# EasyEDA schematic CLAMPER SCHEMATIC.json
TITLE: Sheet_1; REV: 1.0; Date: 2023-09-25; Sheet: 1/1; Drawn By: pv8821; Company: Your Company
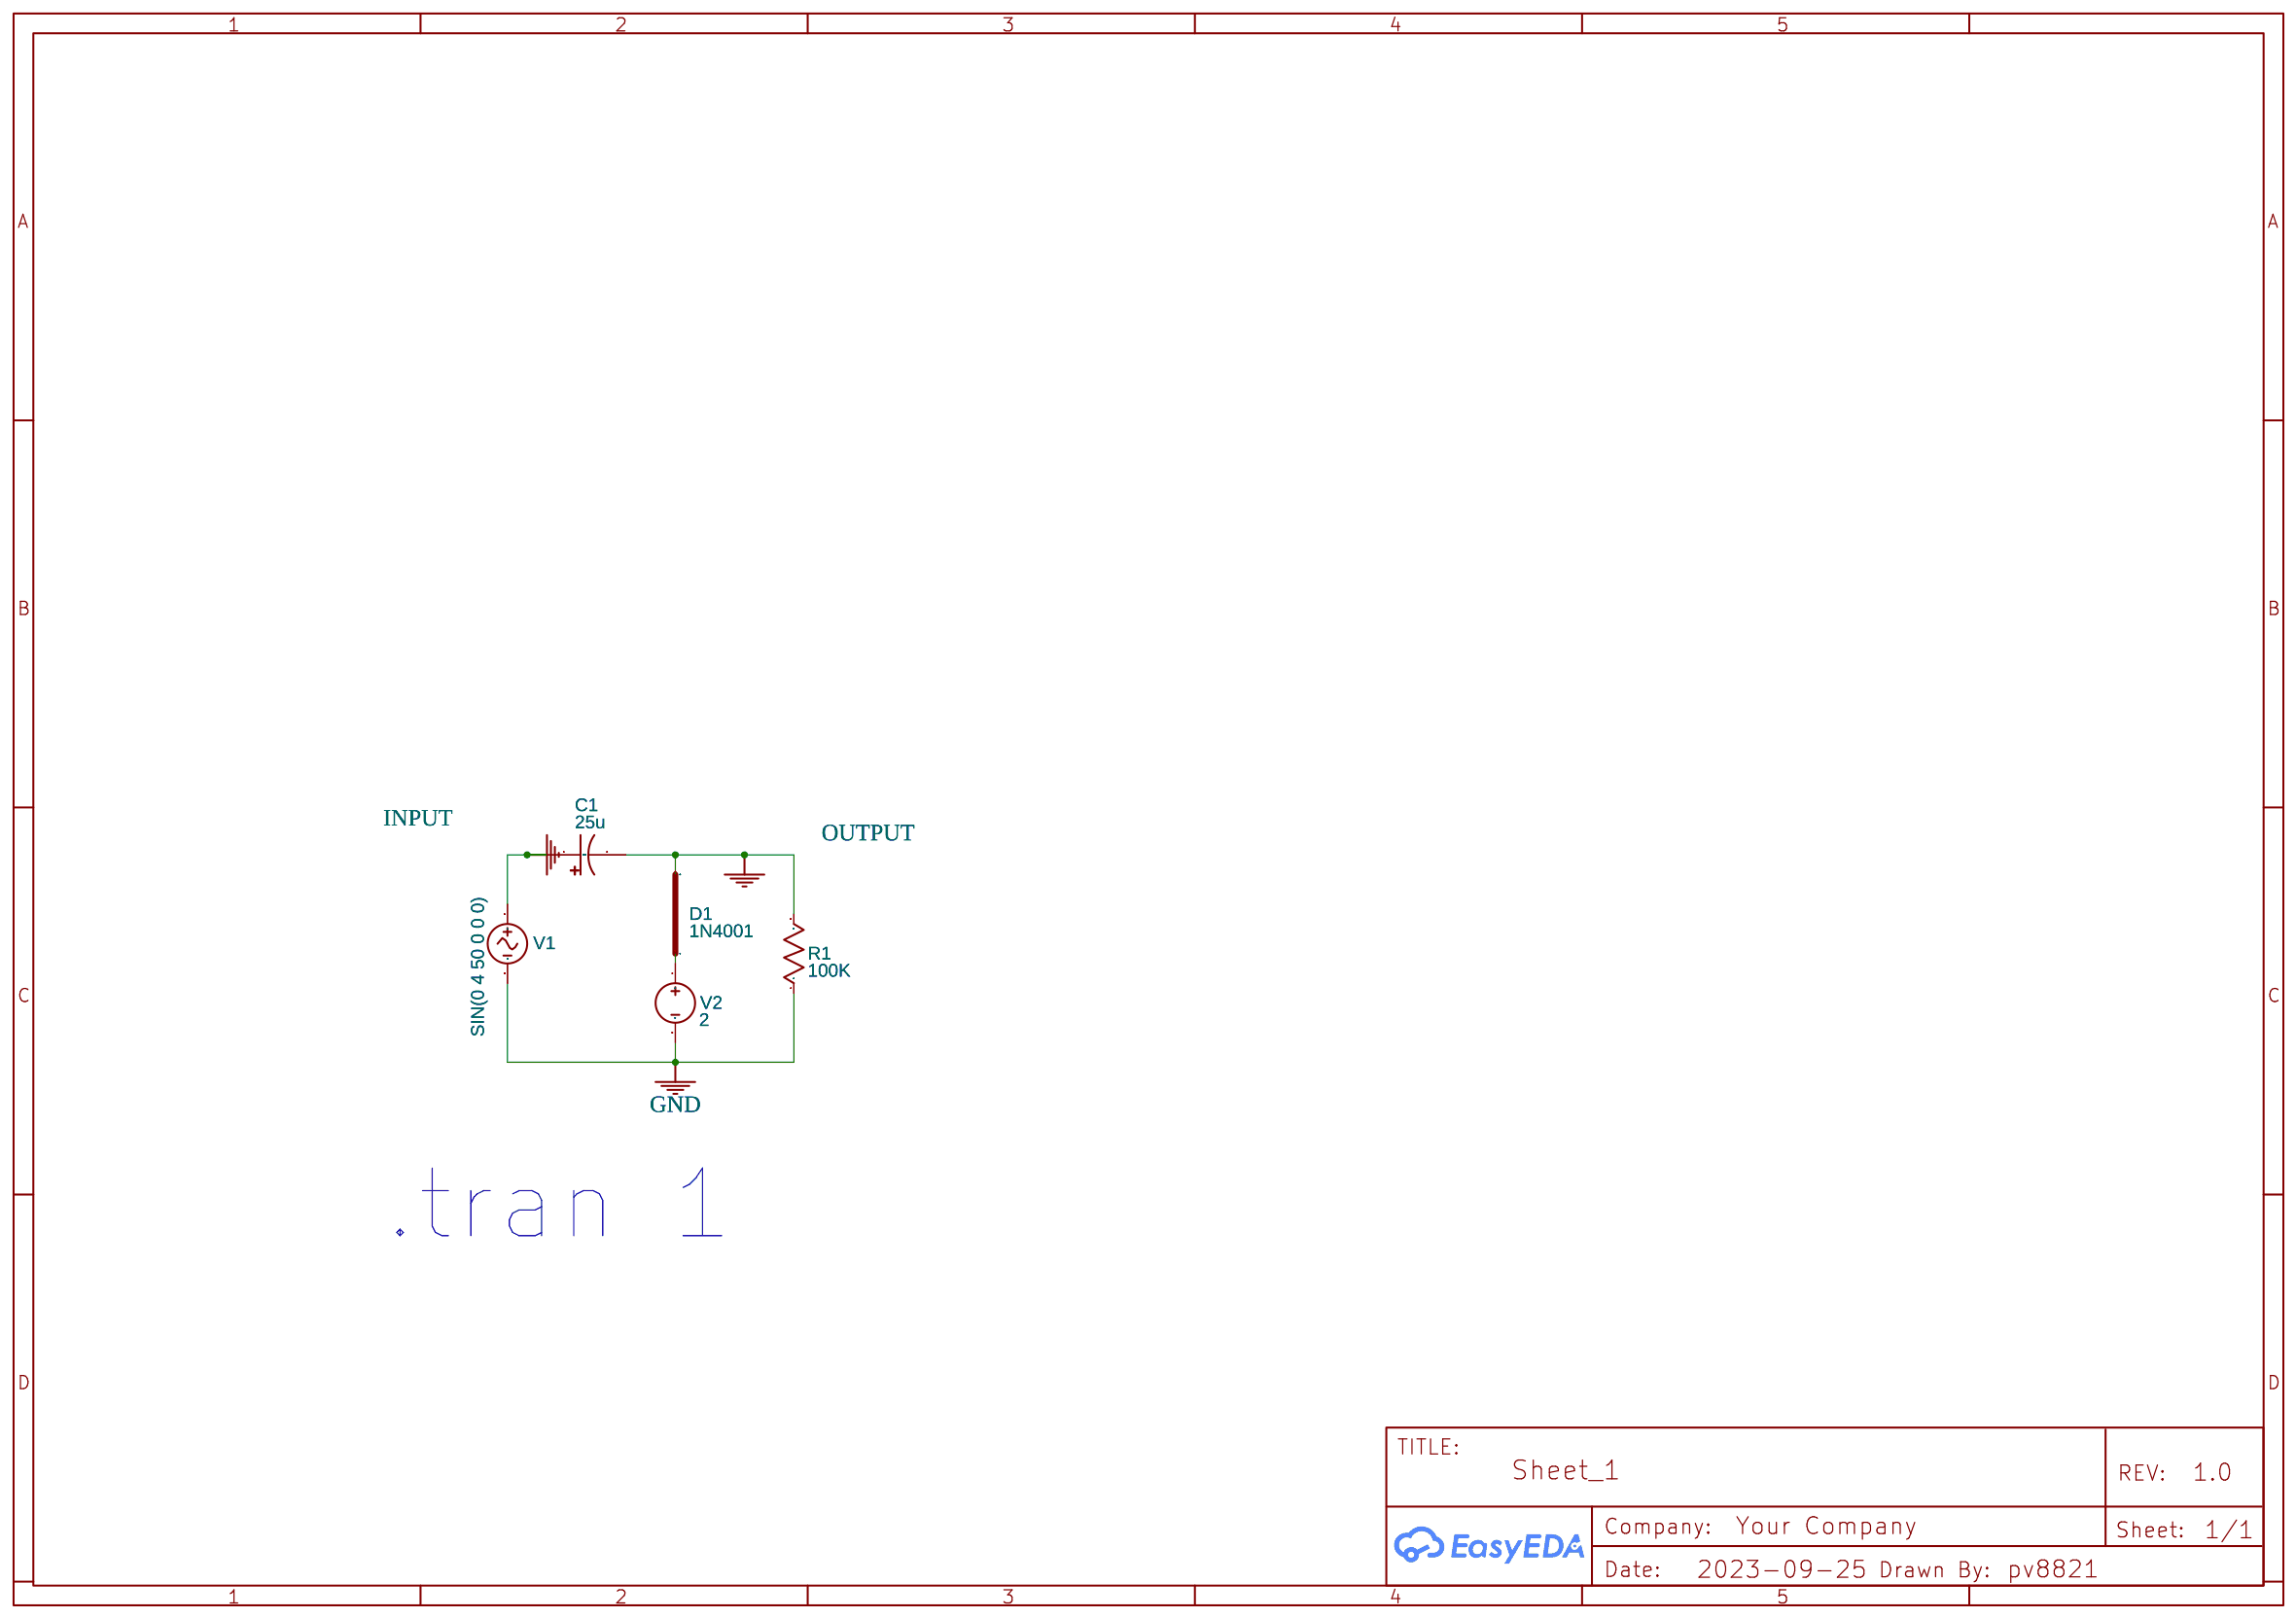
[diagram p0: schematic sheet]

## Parts
C1  25u  [CAP-D3.0XF1.5]
D1  1N4001
R1  100K  [AXIAL-0.3]
V1  SIN(0 4 50 0 0 0)  [HDR1X2]
V2  2  [HDR1X2]

## Library data of the parts
C1 = Capacitor_Electrolytic_US: Supplier: YUJING; Contributor: EasyEDA; Capacitance: 1u
D1 = 1N4001: catid: 20; Contributor: EasyEDA; sim: true
R1 = Resistor_US: Resistance: 1k; Contributor: EasyEDA; Supplier: YUJING
V1 = VSin: Contributor: EasyEDA; sim: true
V2 = VDC: Contributor: EasyEDA; sim: true

## Nets
GND: R1.1 V1.2 V2.2
INPUT: C1.1 V1.1
OUTPUT: C1.2 D1.2 R1.2
Net-(D1-1): D1.1 V2.1

## Notes on the sheet
- .tran 1
